# EAGLE schematic MainMemory (EAGLE 7.6.0)
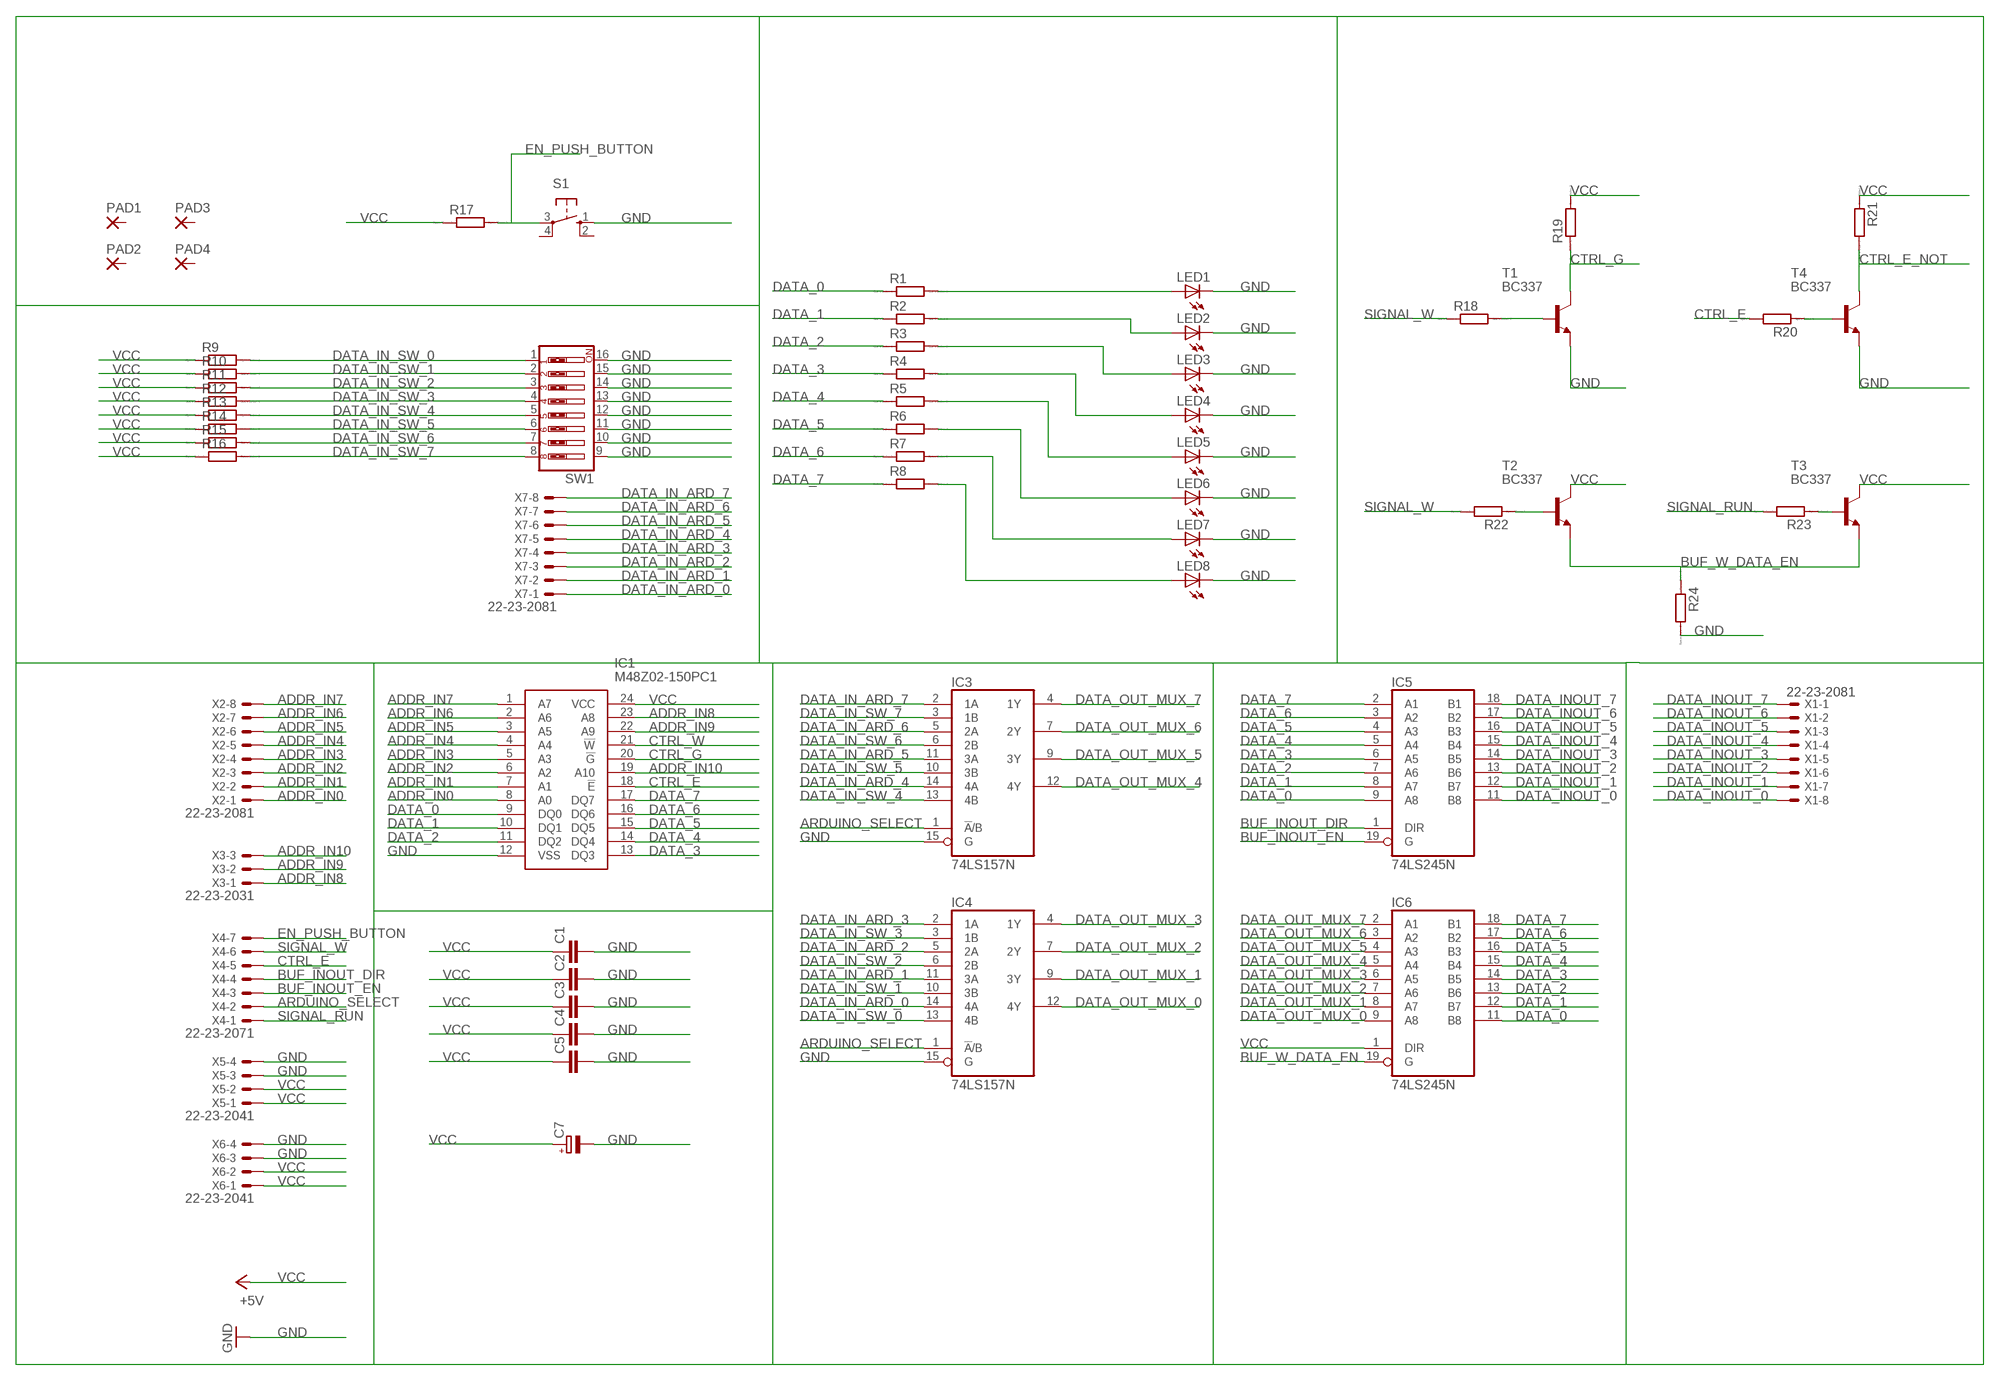
[diagram p0: schematic, sheet 1]

## Parts
C1  C-EU025-025X050  [C025-025X050]
C2  C-EU025-025X050  [C025-025X050]
C3  C-EU025-025X050  [C025-025X050]
C4  C-EU025-025X050  [C025-025X050]
C5  C-EU025-025X050  [C025-025X050]
C7  CPOL-EUE2.5-6  [E2,5-6]
IC1  M48Z02-150PC1  [DIP1562W53P279L3454H965Q24N]
IC3  74LS157N  [DIL16]
IC4  74LS157N  [DIL16]
IC5  74LS245N  [DIL20]
IC6  74LS245N  [DIL20]
LED1  LED5MM  [LED5MM]
LED2  LED5MM  [LED5MM]
LED3  LED5MM  [LED5MM]
LED4  LED5MM  [LED5MM]
LED5  LED5MM  [LED5MM]
LED6  LED5MM  [LED5MM]
LED7  LED5MM  [LED5MM]
LED8  LED5MM  [LED5MM]
PAD1  3,17/1,3  [3,17/1,3]
PAD2  3,17/1,3  [3,17/1,3]
PAD3  3,17/1,3  [3,17/1,3]
PAD4  3,17/1,3  [3,17/1,3]
R1  R0207/10  [0207/10]
R2  R0207/10  [0207/10]
R3  R0207/10  [0207/10]
R4  R0207/10  [0207/10]
R5  R0207/10  [0207/10]
R6  R0207/10  [0207/10]
R7  R0207/10  [0207/10]
R8  R0207/10  [0207/10]
R9  R0207/10  [0207/10]
R10  R0207/10  [0207/10]
R11  R0207/10  [0207/10]
R12  R0207/10  [0207/10]
R13  R0207/10  [0207/10]
R14  R0207/10  [0207/10]
R15  R0207/10  [0207/10]
R16  R0207/10  [0207/10]
R17  R0207/10  [0207/10]
R18  R0207/10  [0207/10]
R19  R0207/10  [0207/10]
R20  R0207/10  [0207/10]
R21  R0207/10  [0207/10]
R22  R0207/10  [0207/10]
R23  R0207/10  [0207/10]
R24  R0207/10  [0207/10]
S1  10-XX  [B3F-10XX]
SW1  SW_DIP-8  [EDG-08]
T1  BC337  [TO92]
T2  BC337  [TO92]
T3  BC337  [TO92]
T4  BC337  [TO92]
X1  22-23-2081  [22-23-2081]
X2  22-23-2081  [22-23-2081]
X3  22-23-2031  [22-23-2031]
X4  22-23-2071  [22-23-2071]
X5  22-23-2041  [22-23-2041]
X6  22-23-2041  [22-23-2041]
X7  22-23-2081  [22-23-2081]

## Nets
ADDR_IN0: IC1.8(A0) X2.1
ADDR_IN1: IC1.7(A1) X2.2
ADDR_IN2: IC1.6(A2) X2.3
ADDR_IN3: IC1.5(A3) X2.4
ADDR_IN4: IC1.4(A4) X2.5
ADDR_IN5: IC1.3(A5) X2.6
ADDR_IN6: IC1.2(A6) X2.7
ADDR_IN7: IC1.1(A7) X2.8
ADDR_IN8: IC1.23(A8) X3.1
ADDR_IN9: IC1.22(A9) X3.2
ADDR_IN10: IC1.19(A10) X3.3
ARDUINO_SELECT: IC3.1(!A!/B) IC4.1(!A!/B) X4.2
BUF_INOUT_DIR: IC5.1(DIR) X4.4
BUF_INOUT_EN: IC5.19(G) X4.3
BUF_W_DATA_EN: IC6.19(G) R24.1 T2.1(E) T3.1(E)
CTRL_E: IC1.18(!E) R20.2 X4.5
CTRL_E_NOT: R21.2 T4.3(C)
CTRL_G: IC1.20(!G) R19.1 T1.3(C)
CTRL_W: IC1.21(!W)
DATA_0: IC1.9(DQ0) IC5.9(A8) IC6.11(B8) R1.1
DATA_1: IC1.10(DQ1) IC5.8(A7) IC6.12(B7) R2.1
DATA_2: IC1.11(DQ2) IC5.7(A6) IC6.13(B6) R3.1
DATA_3: IC1.13(DQ3) IC5.6(A5) IC6.14(B5) R4.1
DATA_4: IC1.14(DQ4) IC5.5(A4) IC6.15(B4) R5.1
DATA_5: IC1.15(DQ5) IC5.4(A3) IC6.16(B3) R6.1
DATA_6: IC1.16(DQ6) IC5.3(A2) IC6.17(B2) R7.1
DATA_7: IC1.17(DQ7) IC5.2(A1) IC6.18(B1) R8.1
DATA_IN_ARD_0: IC4.14(4A) X7.1
DATA_IN_ARD_1: IC4.11(3A) X7.2
DATA_IN_ARD_2: IC4.5(2A) X7.3
DATA_IN_ARD_3: IC4.2(1A) X7.4
DATA_IN_ARD_4: IC3.14(4A) X7.5
DATA_IN_ARD_5: IC3.11(3A) X7.6
DATA_IN_ARD_6: IC3.5(2A) X7.7
DATA_IN_ARD_7: IC3.2(1A) X7.8
DATA_IN_SW_0: IC4.13(4B) R9.2 SW1.1
DATA_IN_SW_1: IC4.10(3B) R10.2 SW1.2
DATA_IN_SW_2: IC4.6(2B) R11.2 SW1.3
DATA_IN_SW_3: IC4.3(1B) R12.2 SW1.4
DATA_IN_SW_4: IC3.13(4B) R13.2 SW1.5
DATA_IN_SW_5: IC3.10(3B) R14.2 SW1.6
DATA_IN_SW_6: IC3.6(2B) R15.2 SW1.7
DATA_IN_SW_7: IC3.3(1B) R16.2 SW1.8
DATA_INOUT_0: IC5.11(B8) X1.8
DATA_INOUT_1: IC5.12(B7) X1.7
DATA_INOUT_2: IC5.13(B6) X1.6
DATA_INOUT_3: IC5.14(B5) X1.5
DATA_INOUT_4: IC5.15(B4) X1.4
DATA_INOUT_5: IC5.16(B3) X1.3
DATA_INOUT_6: IC5.17(B2) X1.2
DATA_INOUT_7: IC5.18(B1) X1.1
DATA_OUT_MUX_0: IC4.12(4Y) IC6.9(A8)
DATA_OUT_MUX_1: IC4.9(3Y) IC6.8(A7)
DATA_OUT_MUX_2: IC4.7(2Y) IC6.7(A6)
DATA_OUT_MUX_3: IC4.4(1Y) IC6.6(A5)
DATA_OUT_MUX_4: IC3.12(4Y) IC6.5(A4)
DATA_OUT_MUX_5: IC3.9(3Y) IC6.4(A3)
DATA_OUT_MUX_6: IC3.7(2Y) IC6.3(A2)
DATA_OUT_MUX_7: IC3.4(1Y) IC6.2(A1)
EN_PUSH_BUTTON: R17.2 S1.3(P) X4.7
GND [suply]: C1.2 C2.2 C3.2 C4.2 C5.2 C7.- IC1.12(VSS) IC3.15(G) IC4.15(G) LED1.K(C) LED2.K(C) LED3.K(C) LED4.K(C) LED5.K(C) LED6.K(C) LED7.K(C) LED8.K(C) R24.2 S1.1(S) SW1.9 SW1.10 SW1.11 SW1.12 SW1.13 SW1.14 SW1.15 SW1.16 T1.1(E) T4.1(E) X5.3 X5.4 X6.3 X6.4
N$159: LED1.A R1.2
N$160: LED2.A R2.2
N$161: LED3.A R3.2
N$162: LED4.A R4.2
N$163: LED5.A R5.2
N$164: LED6.A R6.2
N$165: LED7.A R7.2
N$166: LED8.A R8.2
N$180: R23.1 T3.2(B)
N$182: R22.1 T2.2(B)
N$190: R18.2 T1.2(B)
N$194: R20.1 T4.2(B)
SIGNAL_RUN: R23.2 X4.1
SIGNAL_W: R18.1 R22.2 X4.6
VCC [suply]: C1.1 C2.1 C3.1 C4.1 C5.1 C7.+ IC1.24(VCC) IC6.1(DIR) R9.1 R10.1 R11.1 R12.1 R13.1 R14.1 R15.1 R16.1 R17.1 R19.2 R21.1 T2.3(C) T3.3(C) X5.1 X5.2 X6.1 X6.2 ; supply symbol labelled +5V
Unconnected: PAD1.1(P) PAD2.1(P) PAD3.1(P) PAD4.1(P) S1.2(S1) S1.4(P1)

## Power pins joined to a net without a drawn wire
GND: IC3.8(GND) IC4.8(GND) IC5.10(GND) IC6.10(GND)
VCC: IC3.16(VCC) IC4.16(VCC) IC5.20(VCC) IC6.20(VCC)

## Library data of the parts
C1-C5 = rcl:C-EU: CAPACITOR, European symbol
C7 = rcl:CPOL-EU: POLARIZED CAPACITOR, European symbol
IC1 = M48Z02-150PC1:M48Z02-150PC1: Source: Datasheet <http://www.st.com/web/en/resource/technical/document/datasheet/CD00000524.pdf>; ALLIED_NUMBER: 70013652; ALLIED_PRICE-STOCK: http://www.alliedelec.com/stmicroelectronics-m48z02-150pc1/70013652/; HEIGHT: 9.65mm; MANUFACTURER_NAME: STMicroelectronics; MANUFACTURER_PART_NUMBER: M48Z02-150PC1; MOUSER_PART_NUMBER: 511-M48Z0215PC1; MOUSER_PRICE-STOCK: https://www.mouser.com/Search/Refine.aspx?Keyword=511-M48Z0215PC1; RS_PART_NUMBER: 8289958; RS_PRICE-STOCK: https://uk.rs-online.com/web/p/products/8289958
IC3 IC4 = 74xx-us:74*157: Quadruple 2-line to 1-line data SELECTOR/MULTIPLEXER
IC5 IC6 = 74xx-us:74*245: Octal BUS TRANSCEIVER, 3-state
LED1-LED8 = led:LED: LED OSRAM: - CHIPLED LG R971, LG N971, LY N971, LG Q971, LY Q971, LO R971, LY R971 LH N974, LH R974 LS Q976, LO Q976, LY Q976 LO Q996 - Hyper CHIPLED LW Q18S LB Q993, LB Q99A, LB R99A - SideLED LS A670, LO A670, LY A670, LG A670, LP A670 LB A673, LV A673, LT A673, LW A673 LH A674 LY A675 LS A676, LA A676, LO A676, LY A676, LW A676 LS A679, LY A679, LG A679 - Hyper Micro SIDELED® LS Y876, LA Y876, LO Y876, LY Y876 LT Y87S - SmartLED LW L88C, LW L88S LB L89C, LB L89S, LG L890 LS L89K, LO L89K, LY L89K LS L896, LA L896, LO L896, LY L896 - TOPLED LS T670, LO T670, LY T670, LG T670, LP T670 LSG T670, LSP T670, LSY T670, LOP T670, LYG T670 LG T671, LOG T671, LSG T671 LB T673, LV T673, LT T673, LW T673 LH T674 LS T676, LA T676, LO T676, LY T676, LB T676, LH T676, LSB T676, LW T676 LB T67C, LV T67C, LT T67C, LS T67K, LO T67K, LY T67K, LW E67C LS E67B, LA E67B, LO E67B, LY E67B, LB E67C, LV E67C, LT E67C LW T67C LS T679, LY T679, LG T679 LS T770, LO T770, LY T770, LG T770, LP T770 LB T773, LV T773, LT T773, LW T773 LH T774 LS E675, LA E675, LY E675, LS T675 LS T776, LA T776, LO T776, LY T776, LB T776 LHGB T686 LT T68C, LB T68C - Hyper Mini TOPLED® LB M676 - Mini TOPLED Santana® LG M470 LS M47K, LO M47K, LY M47K Source: http://www.osram.convergy.de LUXEON: - LUMILED® LXK2-PW12-R00, LXK2-PW12-S00, LXK2-PW14-U00, LXK2-PW14-V00 LXK2-PM12-R00, LXK2-PM12-S00, LXK2-PM14-U00 LXK2-PE12-Q00, LXK2-PE12-R00, LXK2-PE12-S00, LXK2-PE14-T00, LXK2-PE14-U00 LXK2-PB12-K00, LXK2-PB12-L00, LXK2-PB12-M00, LXK2-PB14-N00, LXK2-PB14-P00, LXK2-PB14-Q00 LXK2-PR12-L00, LXK2-PR12-M00, LXK2-PR14-Q00, LXK2-PR14-R00 LXK2-PD12-Q00, LXK2-PD12-R00, LXK2-PD12-S00 LXK2-PH12-R00, LXK2-PH12-S00 LXK2-PL12-P00, LXK2-PL12-Q00, LXK2-PL12-R00 Source: www.luxeon.com KINGBRIGHT: KA-3528ASYC Source: www.kingbright.com
PAD1-PAD4 = wirepad:3,17/1,3: THROUGH-HOLE PAD
R1-R24 = eagle-ltspice:R: RESISTOR, European symbol; SPICEMODEL: NONE; SPICEPREFIX: R
S1 = switch-omron:10-XX: OMRON SWITCH; MPN: B3F-1000; OC_FARNELL: 176432; OC_NEWARK: 36M3542
SW1 = special:SW_DIP-8: DIP SWITCH
T1-T4 = transistor-neu-to92:BC337: NPN TRANSISTOR
X1 X2 X7 = con-molex:22-23-2081: .100" (2.54mm) Center Header - 8 Pin; MF: MOLEX; MPN: 22-23-2081; OC_FARNELL: 1756826; OC_NEWARK: 01C7592
X3 = con-molex:22-23-2031: .100" (2.54mm) Center Header - 3 Pin; MF: MOLEX; MPN: 22-23-2031; OC_FARNELL: 1462950; OC_NEWARK: 30C0862
X4 = con-molex:22-23-2071: .100" (2.54mm) Center Header - 7 Pin; MF: MOLEX; MPN: 22-23-2071; OC_FARNELL: 1654534; OC_NEWARK: 56H0445
X5 X6 = con-molex:22-23-2041: .100" (2.54mm) Center Header - 4 Pin; MF: MOLEX; MPN: 22-23-2041; OC_FARNELL: 1462920; OC_NEWARK: 38C0355

## Net classes
1 suply: width 0.889 mm